# Altium schematic sheet BOARD3_wifi.SchDoc
size A3; Organization: Altium Limited; Address1: L3, 12a Rodborough Rd; Address2: Frenchs Forest; Address3: NSW; Address4: Australia 2086
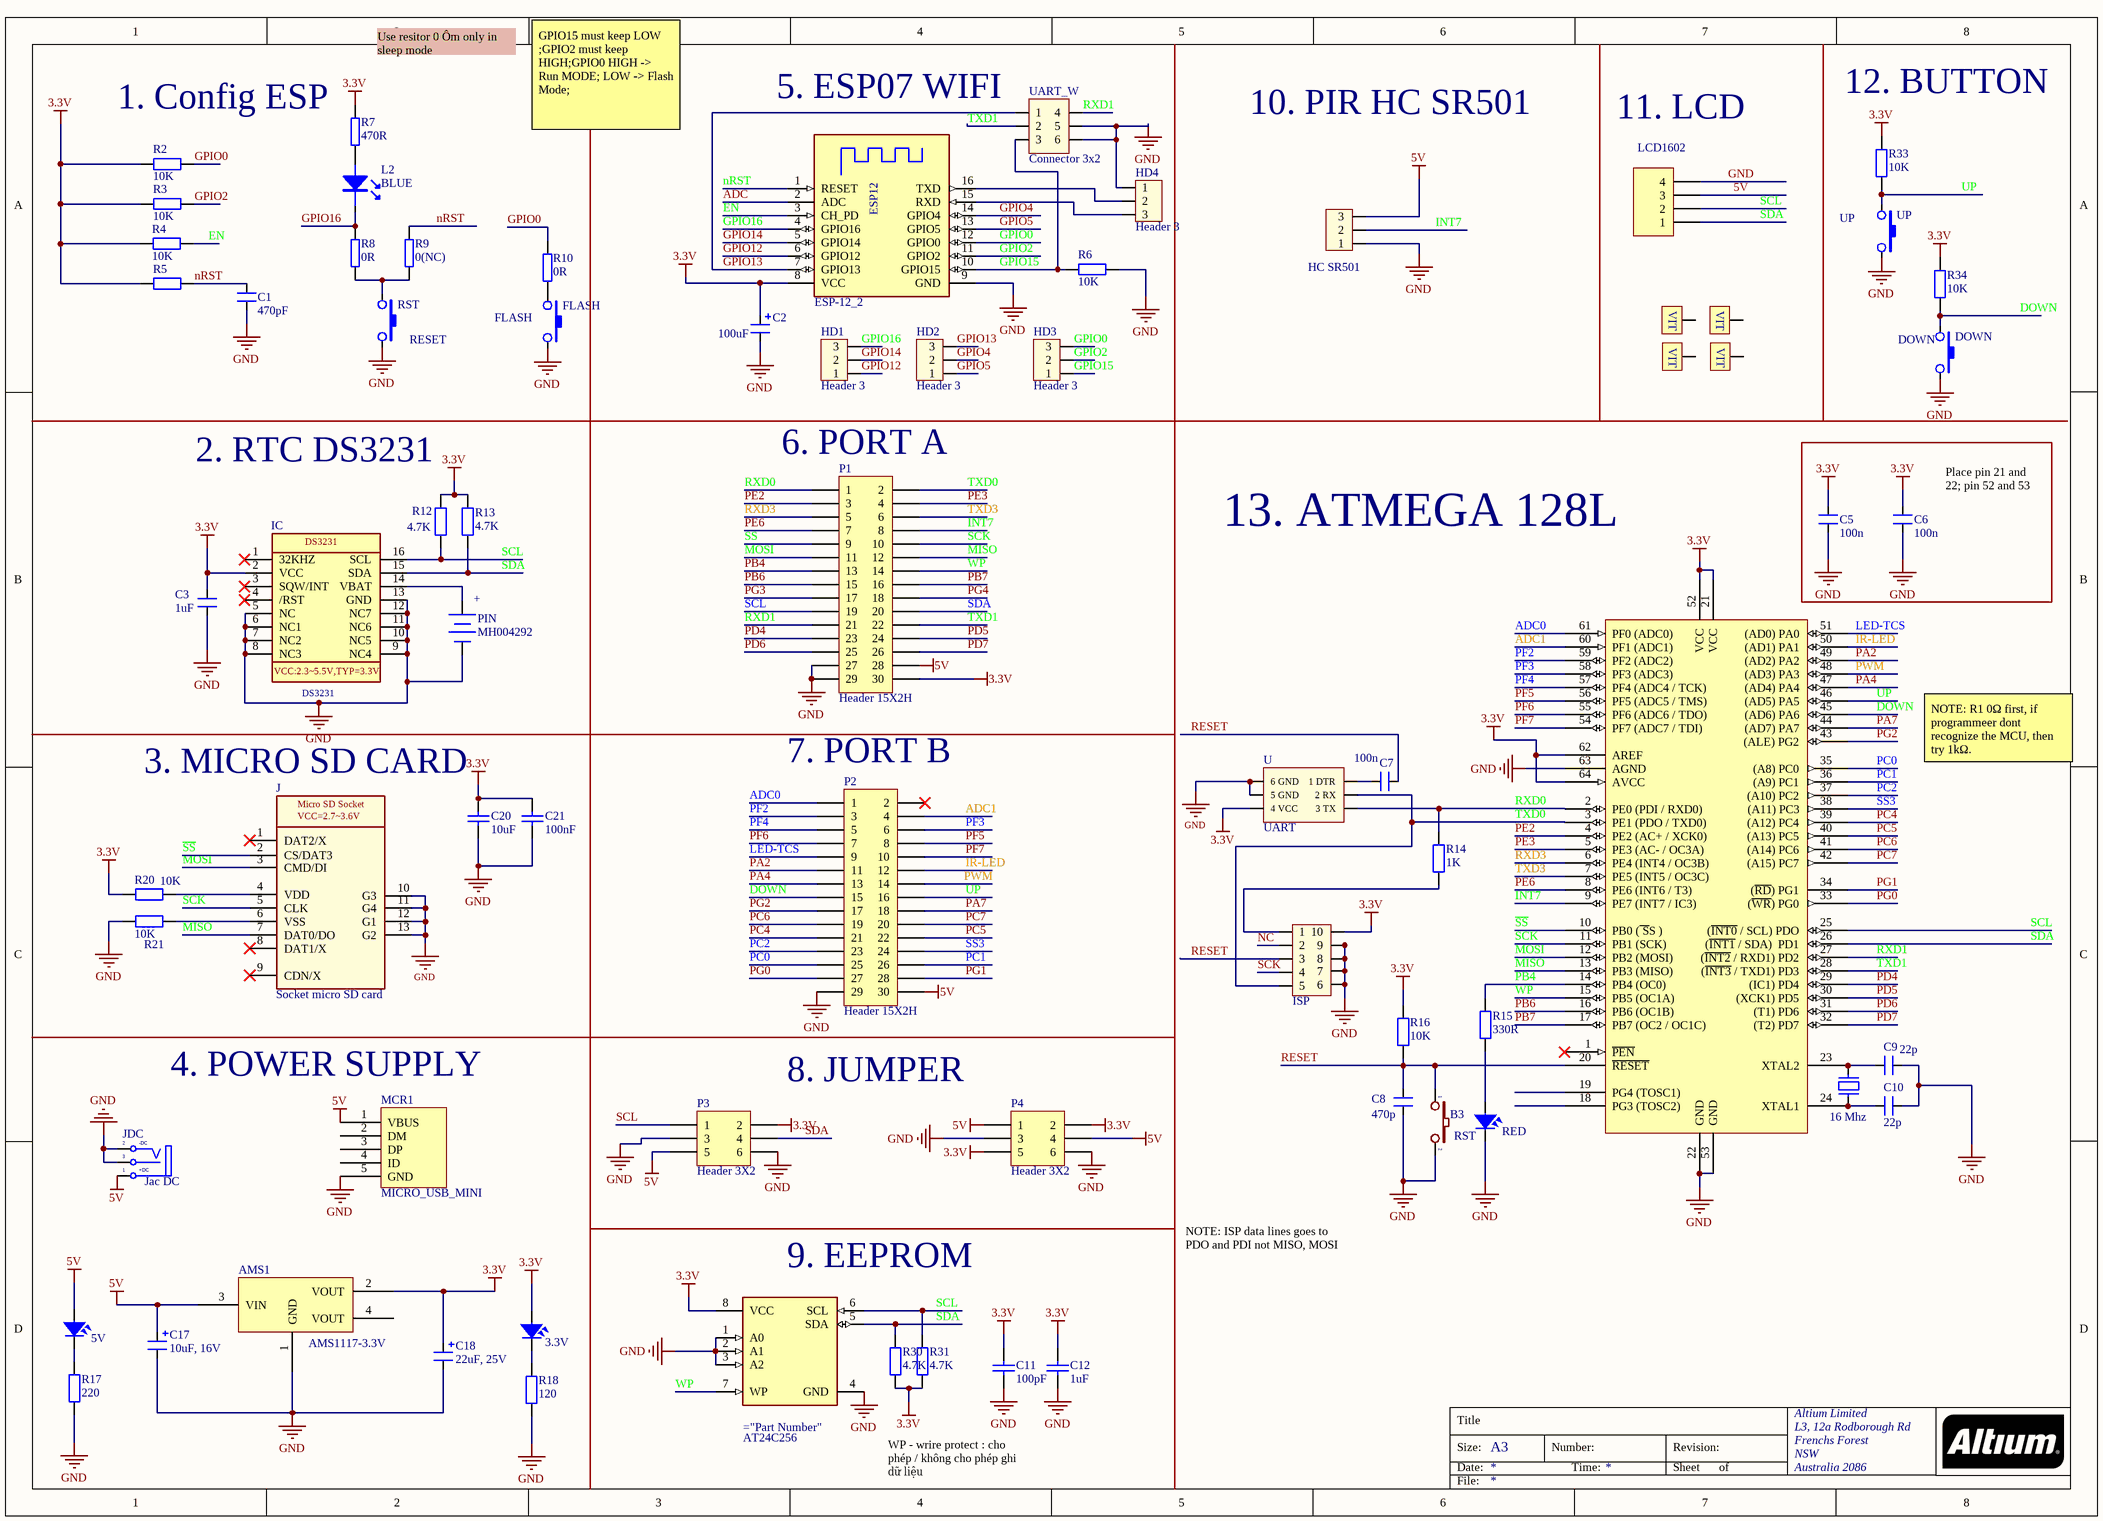
[diagram p0: BOARD3_wifi.SchDoc]

## Parts
(Parts that share a designator on the sheet are numbered #1, #2 ... from top to bottom, then left to right.)
3.3V  LED SMD  [Led 0805Y]  (value not drawn)
5._ESP07_WIFI  ESP-12_2  [ESP-12]
5V  LED SMD  [Led 0805R]  (value not drawn)
?  ISP  [JP5X2]
AMS1  AMS1117-3.3V  [SOT223-4N]
AT24C256  AT24C256C-SSHL-T  [Microchip_8S1_0]  (value not drawn)
C1  470pF  [Cap Ceramic 0805 SMD]
C2  100uF  [SM-CAP-tantalum smd3528]
C3  1uF  [Cap Ceramic 0805 SMD]
C5  100n  [Cap Ceramic 0805 SMD]
C6  100n  [Cap Ceramic 0805 SMD]
C7  100n  [Cap Ceramic 0805 SMD]
C8  470p  [Cap Ceramic 0805 SMD]
C9  22p  [Cap Ceramic 0805 SMD]
C10  22p  [Cap Ceramic 0805 SMD]
C11  100pF  [Tu 0805]
C12  1uF  [Tu 0805]
C17  10uF, 16V  [C_FC_10UF_16V]
C18  22uF, 25V  [C_FC_22UF_25V]
C20  10uF  [Cap Ceramic 0805 SMD]
C21  100nF  [Cap Ceramic 0805 SMD]
DOWN  DOWN  [SW2_SMD 3x6x2.5]
FLASH  FLASH  [SW2_SMD 3x6x2.5]
HD1  Header 3  [Header_3]
HD2  Header 3  [Header_3]
HD3  Header 3  [Header_3]
HD4  Header 3  [Header_3]
Header_4  Header 4  [JP4 F-lcd]  (value not drawn)
IC  DS3231  [SOIC-16]  (value not drawn)
J  Socket micro SD card  [microSD™ Card_TF]
JDC  Jac DC  [DC-IN]
L2  BLUE  [Led 0805BL]
MCR1  MICRO_USB_MINI  [MICRO_USB_SMD_MODIFY]
MCU  13. ATMEGA 128L  [Atmega 128L]
P1  Header 15X2H  [HED15X2H]
P2  Header 15X2H  [HED15X2H]
P3  Header 3X2  [JP3x2]
P4  Header 3X2  [JP3x2]
PIN  MH004292  [DE PINCR1220]
PIR  JP3  [CON3 - HCSR501]  (value not drawn)
R2  10K  [Res 0805 SMD]
R3  10K  [Res 0805 SMD]
R4  10K  [Res 0805 SMD]
R5  10K  [Res 0805 SMD]  (value not drawn)
R6  10K  [Res 0805 SMD]
R7  470R  [Res 0805 SMD]
R8  0R  [Res 0805 SMD]
R9  0(NC)  [Res 0805 SMD]
R10  0R  [Res 0805 SMD]
R12  4.7K  [Res 0805 SMD]
R13  4.7K  [Res 0805 SMD]
R14  1K  [Res 0805 SMD]
R15  330R  [Res 0805 SMD]
R16  10K  [Res 0805 SMD]
R17  220  [Res 0805 SMD]
R18  120  [Res 0805 SMD]
R20  10K  [Res 0805 SMD]
R21  10K  [Res 0805 SMD]
R30  4.7K  [Res 0805 SMD]
R31  4.7K  [Res 0805 SMD]
R33  10K  [Res 0805 SMD]
R34  10K  [Res 0805 SMD]
RED  LED SMD  [Led 0805R]  (value not drawn)
RST#1  RESET  [SW2_SMD 3x6x2.5]
RST#2  B3  [SW2_SMD 3x6x2.5]
U  UART  [JP3x2]
UART_W  Connector 3x2  [HDR2X3]
UP  UP  [SW2_SMD 3x6x2.5]
VIT2  1  [Screw 3 small]  (value not drawn)
VIT3  1  [Screw 3 small]  (value not drawn)
VIT5  1  [Screw 3 small]  (value not drawn)
VIT6  1  [Screw 3 small]  (value not drawn)
X1  16 Mhz  [XT2]

## Nets
3.3V: 3.3V.1 5._ESP07_WIFI.8(VCC) ?.10 AMS1.2(VOUT) AT24C256.8(VCC) C2.1 C3.2 C5.1 C6.1 C11.2 C12.2 C18.1 C20.2 C21.2 IC.2(VCC) MCU.21(VCC) MCU.52(VCC) MCU.62(AREF) MCU.64(AVCC) P1.30 P3.2 P4.2 P4.5 R2.1 R3.1 R4.1 R5.1 R7.2 R12.2 R13.2 R16.2 R20.1 R30.2 R31.2 R33.2 R34.2 U.4(4_VCC)
5V: 5V.1 AMS1.3(VIN) C17.1 Header_4.3 JDC.1(T) MCR1.1(VBUS) P1.28 P2.30 P3.5 P4.1 P4.4 PIR.3
GND: 5._ESP07_WIFI.9(GND) ?.6 ?.7 ?.8 ?.9 AMS1.1(GND) AT24C256.1(A0) AT24C256.2(A1) AT24C256.3(A2) AT24C256.4(GND) C1.1 C2.2 C3.1 C5.2 C6.2 C8.1 C9.2 C10.2 C11.1 C12.1 C17.2 C18.2 C20.1 C21.1 DOWN.2 FLASH.2 HD4.1 Header_4.4 IC.5(NC) IC.6(NC1) IC.7(NC2) IC.8(NC3) IC.9(NC4) IC.10(NC5) IC.11(NC6) IC.12(NC7) IC.13(GND) J.10(G3) J.11(G4) J.12(G1) J.13(G2) JDC.2(TN) JDC.3(S) MCR1.5(GND) MCU.22(GND) MCU.53(GND) MCU.63(AGND) P1.27 P1.29 P2.29 P3.3 P3.6 P4.3 P4.6 PIN.2(-) PIR.1 R6.1 R17.1 R18.1 R21.1 RED.2 RST#1.2 RST#2.2 U.5(5_GND) U.6(6_GND) UART_W.5 UART_W.6 UP.2
ADC: 5._ESP07_WIFI.2(ADC)
ADC0: MCU.61(PF0_(ADC0)) P2.1
ADC1: MCU.60(PF1_(ADC1)) P2.4
DOWN: DOWN.1 MCU.45((AD6)_PA6) P2.15 R34.1
EN: 5._ESP07_WIFI.3(CH_PD) R4.2
GPIO0: 5._ESP07_WIFI.12(GPIO0) HD3.3 R2.2 R10.2
GPIO2: 5._ESP07_WIFI.11(GPIO2) HD3.2 R3.2
GPIO4: 5._ESP07_WIFI.14(GPIO4) HD2.2
GPIO5: 5._ESP07_WIFI.13(GPIO5) HD2.1
GPIO12: 5._ESP07_WIFI.6(GPIO12) HD1.1
GPIO13: 5._ESP07_WIFI.7(GPIO13) HD2.3 UART_W.1
GPIO14: 5._ESP07_WIFI.5(GPIO14) HD1.2
GPIO15: 5._ESP07_WIFI.10(GPIO15) HD3.1 R6.2 UART_W.3
GPIO16: 5._ESP07_WIFI.4(GPIO16) HD1.3 L2.2(K) R8.2
INT7: MCU.9(PE7_(INT7_/_IC3)) P1.8 PIR.2
IR-LED: MCU.50((AD1)_PA1) P2.12
LED-TCS: MCU.51((AD0)_PA0) P2.9
MISO: J.7(DAT0/DO) MCU.13(PB3_(MISO)) P1.12
MOSI: J.3(CMD/DI) MCU.12(PB2_(MOSI)) P1.11
NC: ?.2
nRST: 5._ESP07_WIFI.1(RESET) C1.2 R5.2 R9.2
PA2: MCU.49((AD2)_PA2) P2.11
PA4: MCU.47((AD4)_PA4) P2.13
PA7: MCU.44((AD7)_PA7) P2.18
PB4: MCU.14(PB4_(OC0)) P1.13 R15.1
PB6: MCU.16(PB6_(OC1B)) P1.15
PB7: MCU.17(PB7_(OC2_/_OC1C)) P1.16
PC0: MCU.35((A8)_PC0) P2.25
PC1: MCU.36((A9)_PC1) P2.26
PC2: MCU.37((A10)_PC2) P2.23
PC4: MCU.39((A12)_PC4) P2.21
PC5: MCU.40((A13)_PC5) P2.22
PC6: MCU.41((A14)_PC6) P2.19
PC7: MCU.42((A15)_PC7) P2.20
PD4: MCU.29((IC1)_PD4) P1.23
PD5: MCU.30((XCK1)_PD5) P1.24
PD6: MCU.31((T1)_PD6) P1.25
PD7: MCU.32((T2)_PD7) P1.26
PE2: MCU.4(PE2_(AC+_/_XCK0)) P1.3
PE3: MCU.5(PE3_(AC-_/_OC3A)) P1.4
PE6: MCU.8(PE6_(INT6_/_T3)) P1.7
PF2: MCU.59(PF2_(ADC2)) P2.3
PF3: MCU.58(PF3_(ADC3)) P2.6
PF4: MCU.57(PF4_(ADC4_/_TCK)) P2.5
PF5: MCU.56(PF5_(ADC5_/_TMS)) P2.8
PF6: MCU.55(PF6_(ADC6_/_TDO)) P2.7
PF7: MCU.54(PF7_(ADC7_/_TDI)) P2.10
PG0: MCU.33((~{WR})_PG0) P2.27
PG1: MCU.34((~{RD})_PG1) P2.28
PG2: MCU.43((ALE)_PG2) P2.17
PG3: P1.17
PG4: P1.18
PWM: MCU.48((AD3)_PA3) P2.14
RESET: ?.3 C7.2 C8.2 MCU.20(~{RESET}) R16.1 RST#2.1
RXD0: MCU.2(PE0_(PDI_/_RXD0)) P1.1 R14.2 U.3(3_TX)
RXD1: MCU.27((~{INT2}_/_RXD1)_PD2) P1.21 UART_W.4
RXD3: MCU.6(PE4_(INT4_/_OC3B)) P1.5
~{SS}: J.2(CS/DAT3) MCU.10(PB0_(~{_S}S_)) P1.9
SCK: ?.4 J.5(CLK) MCU.11(PB1_(SCK)) P1.10
SCL: AT24C256.6(SCL) Header_4.2 IC.16(SCL) MCU.25((~{INT0}_/_SCL)_PDO) P1.19 P3.1 R12.1 R31.1
SDA: AT24C256.5(SDA) Header_4.1 IC.15(SDA) MCU.26((~{INT1}_/_SDA)__PD1) P1.20 P3.4 R13.1 R30.1
SS3: MCU.38((A11)_PC3) P2.24
TXD0: ?.5 MCU.3(PE1_(PDO_/_TXD0)) P1.2 U.2(2_RX)
TXD1: MCU.28((~{INT3}_/_TXD1)_PD3) P1.22 UART_W.2
TXD3: MCU.7(PE5_(INT5_/_OC3C)) P1.6
UP: MCU.46((AD5)_PA5) P2.16 R33.1 UP.1
WP: AT24C256.7(WP) MCU.15(PB5_(OC1A)) P1.14
Net3.3V_2: 3.3V.2 R18.2
Net5._ESP07_WIFI_15: 5._ESP07_WIFI.15(RXD) HD4.3
Net5._ESP07_WIFI_16: 5._ESP07_WIFI.16(TXD) HD4.2
Net5V_2: 5V.2 R17.2
Net?_1: ?.1 R14.1
NetC7_1: C7.1 U.1(1_DTR)
NetC9_1: C9.1 MCU.23(XTAL2) X1.2
NetC10_1: C10.1 MCU.24(XTAL1) X1.1
NetFLASH_1: FLASH.1 R10.1
NetIC_14: IC.14(VBAT) PIN.1(+)
NetJ_4: J.4(VDD) R20.2
NetJ_6: J.6(VSS) R21.2
NetL2_1: L2.1(A) R7.1
NetR8_1: R8.1 R9.1 RST#1.1
NetR15_2: R15.2 RED.1

Not connected (* = marked no-connect by the designer): AMS1 4(VOUT); IC 1(32KHZ) 3(SQW/INT) 4(/RST); J 1(DAT2/X)* 8(DAT1/X)* 9(CDN/X)*; MCR1 2(DM) 3(DP) 4(ID); MCU 1(~{PEN})* 18(PG3_(TOSC2)) 19(PG4_(TOSC1)); P2 2*; VIT2 VIT1(1); VIT3 VIT1(1); VIT5 VIT1(1); VIT6 VIT1(1)

## Notes on the sheet
- Use resitor 0 Ôm only in
  sleep mode
- (near R7) 1. Config ESP
- GPIO15 must keep LOW ;GPIO2 must keep HIGH;GPIO0 HIGH -> Run MODE; LOW -> Flash Mode;
- 10. PIR HC SR501
- (near Header_4) 11. LCD
- (near R33) 12. BUTTON
- (near Header_4) LCD1602
- (near PIR) HC SR501
- (near P1) 6. PORT A
- 2. RTC DS3231
- (near C6) Place pin 21 and 22; pin 52 and 53
- (near PIN) +
- 3. MICRO SD CARD
- (near P2) 7. PORT B
- NOTE: R1 0Ω first, if programmeer dont recognize the MCU, then try 1kΩ.
- (near MCR1) 4. POWER SUPPLY
- 8. JUMPER
- (near AT24C256) 9. EEPROM
- NOTE: ISP data lines goes to PDO and PDI not MISO, MOSI
- WP - wrire protect : cho phép / không cho phép ghi dữ liệu
- Title
- Size:
- Date:
- A3
- Number:
- Time:
- Revision:
- Sheet
- of
- File:
- (in symbol DCIN) -DC; +DC
- (in symbol DS3231) VCC:2.3~5.5V,TYP=3.3V
- (in symbol Socket micro SD card) Micro SD Socket; VCC=2.7~3.6V

## Library data of the parts
3.3V 5V RED = LED-SMD-0805
5._ESP07_WIFI = ESP-12_2: WiFi 802.11b/g/n Transceiver Module 2.412GHz ~ 2.484GHz PCB Trace Surface Mount; MP: ESP12; MF: RF Solutions; Availability: Unavailable; SnapEDA_Link: https://www.snapeda.com/parts/ESP12/RF%20Solutions/view-part/225799/?ref=snap; Package: None; Price: None; Value: *
? = JP5X2
AMS1 = AMS1117: Dán; Value: AMS1117-3.3V SOT223; Don_Vi: Con; Ma_Hang: MH000596; Ghi_Chu: *; Kieu_Chan: *; Chung_Loai: Dán
C1 C3 = CM: Cap SMD
  C1: Value: 470pF
  C3: Value: 1uF
C2 C17 C18 = CM-TANTALUM: Cap SMD, TANTALUM; Value: 103
C5-C10 = CM: Cap SMD; Value: 103
C11 C12 C20 C21 = Tu 102: Dán; Ten_Linh_Kien: Tụ 0805 102-1nF 10% 50V; Ma_Hang: MH004549; Don_Vi: Con; Kieu_Chan: *; Ghi_Chu: *; Chung_Loai: Dán
DOWN FLASH RST#1 UP = SMT_SW_PTS_820: SMT Tactile ‎Switch PTS 820 Series
HD1-HD4 = Header3: Value: Header 3
Header_4 = Header 4: Header, 4-Pin,; LatestRevisionDate: 17-Jul-2002; LatestRevisionNote: Re-released for DXP Platform.; Publisher: Altium Limited
IC = DS3231: RTC DS3231; MF: Maxim Integrated; Value: *; MP: DS3231; Package: SOIC-16 Maxim Integrated; Price: None; SnapEDA_Link: https://www.snapeda.com/parts/DS3231/Maxim%20Integrated/view-part/553791/?ref=snap; Availability: Unavailable
J = Socket micro SD card: 10 _8 + 2_ Position Card Connector Secure Digital - microSDâ„¢ Surface Mount, Right Angle Gold; MP: 502570-0893; MF: Molex; Price: None; Package: None; Value: *; Availability: Unavailable; SnapEDA_Link: https://www.snapeda.com/parts/502570-0893/Molex/view-part/225170/?ref=snap
JDC = DCIN: Jac DC input; Value: Jac DC
L2 = SMT_LED_0603: SMT LED
MCU = Atmega128L: 8-Bit AVR Microcontroller with 128K Bytes of In-System Programmable Flash Memory; Value: Atmega 128L
P1 P2 = Header 15X2H: Header, 15-Pin, Dual row, Right Angle; LatestRevisionDate: 17-Jul-2002; LatestRevisionNote: Re-released for DXP Platform.; Publisher: Altium Limited
P3 P4 = Header 3X2: Header, 3-Pin, Dual row; LatestRevisionDate: 17-Jul-2002; LatestRevisionNote: Re-released for DXP Platform.; Publisher: Altium Limited
PIN = De Pin 3.3V: Dán; LatestRevisionDate: Đế Pin CR2032 SMD003
PIR = Con3: Connector 3; Value: Connector 3
R2-R6 R12-R14 R20 R21 R30 R31 R33 R34 = RM: Resistor SMD
  R2-R6 R20 R21 R33 R34: Value: 10K
  R12 R13 R30 R31: Value: 4.7K
  R14: Value: 1K
R7-R10 = SMT_R_0402: Surface mount resistor 0402
R15-R18 = RM: Resistor SMD; Value: 1K
RST#2 = SW2: Switch button 2 pin; Value: SW chip 2 pin
U = Uart header
UART_W = JP3x2: Value: Connector 3x2
VIT2 VIT3 VIT5 VIT6 = VIT: Oc Vit
X1 = XT32k: Crystal 32,768kHz for timer real; Value: 32,768khz